# Altium project take1.PrjPcb
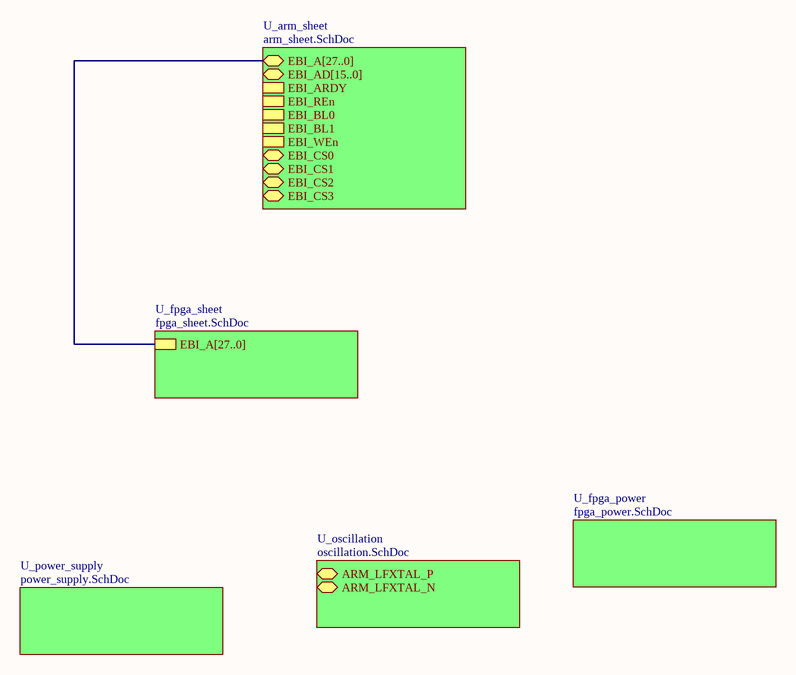
[diagram p0: overall.SchDoc]
6 sheets, 24 parts. Net scope: hierarchical (ports join the sheet entries above them; power ports are global).
Sheets:
  overall.SchDoc
    U_arm_sheet = arm_sheet.SchDoc
    U_fpga_power = fpga_power.SchDoc
    U_fpga_sheet = fpga_sheet.SchDoc
    U_power_supply = power_supply.SchDoc
    U_oscillation = oscillation.SchDoc

## Sheet overall.SchDoc
size A4

### Sub-sheets
U_arm_sheet = arm_sheet.SchDoc: EBI_A[27..0] (bidir), EBI_AD[15..0] (bidir), EBI_ARDY, EBI_REn, EBI_BL0, EBI_BL1, EBI_WEn, EBI_CS0 (bidir), EBI_CS1 (bidir), EBI_CS2 (bidir), EBI_CS3 (bidir)
U_fpga_power = fpga_power.SchDoc: no entries
U_fpga_sheet = fpga_sheet.SchDoc: EBI_A[27..0]
U_oscillation = oscillation.SchDoc: ARM_LFXTAL_P (bidir), ARM_LFXTAL_N (bidir)
U_power_supply = power_supply.SchDoc: no entries

### Buses and harness runs
bus sheet U_arm_sheet/EBI_A[27..0] = sheet U_fpga_sheet/EBI_A[27..0]

## Sheet arm_sheet.SchDoc
size A4
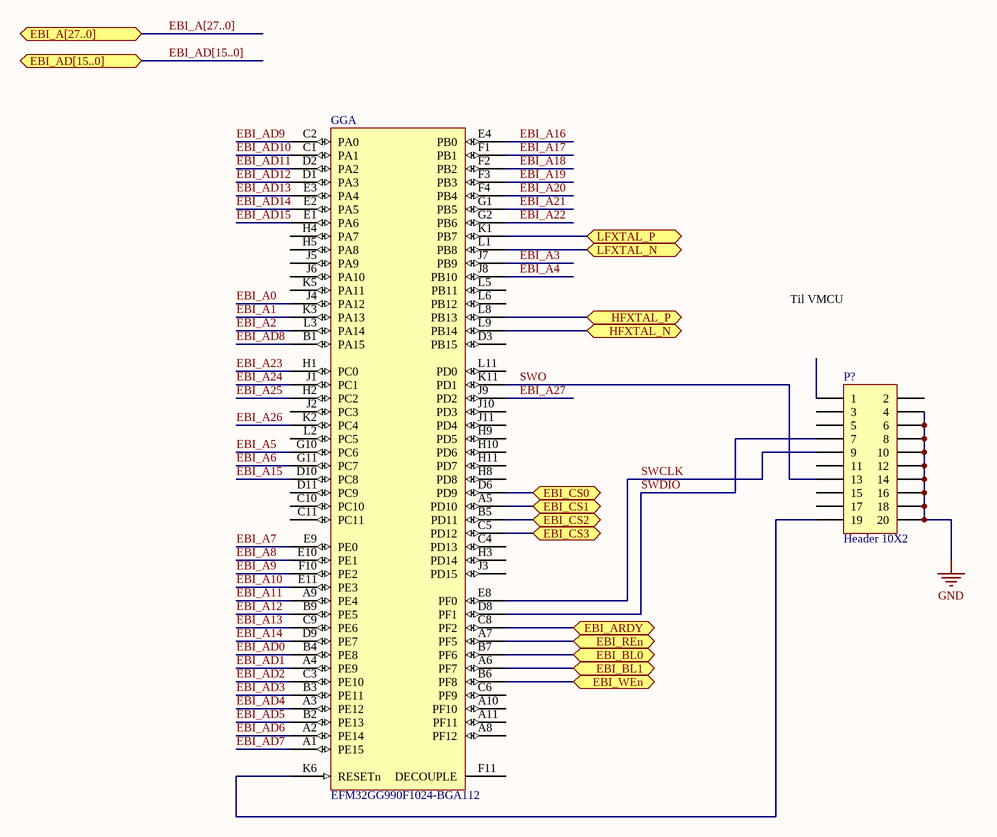
[diagram p1: arm_sheet.SchDoc]

### Parts
GG  EFM32GG990F1024-BGA112  [ENMR-BGA112]  (part A of 2)
P?  Header 10X2  [HDR2X10]

### Ports
EBI_A[27..0] (bidir), EBI_AD[15..0] (bidir), EBI_ARDY, EBI_BL0, EBI_BL1, EBI_CS0 (bidir), EBI_CS1 (bidir), EBI_CS2 (bidir), EBI_CS3 (bidir), EBI_REn, EBI_WEn, HFXTAL_N (bidir), HFXTAL_P (bidir), LFXTAL_N, LFXTAL_P

### Nets
GND: P?.4 P?.6 P?.8 P?.10 P?.12 P?.14 P?.16 P?.18 P?.20
EBI_A0: GG.J4(PA12)
EBI_A1: GG.K3(PA13)
EBI_A2: GG.L3(PA14)
EBI_A3: GG.J7(PB9)
EBI_A4: GG.J8(PB10)
EBI_A5: GG.G10(PC6)
EBI_A6: GG.G11(PC7)
EBI_A7: GG.E9(PE0)
EBI_A8: GG.E10(PE1)
EBI_A9: GG.F10(PE2)
EBI_A10: GG.E11(PE3)
EBI_A11: GG.A9(PE4)
EBI_A12: GG.B9(PE5)
EBI_A13: GG.C9(PE6)
EBI_A14: GG.D9(PE7)
EBI_A15: GG.D10(PC8)
EBI_A16: GG.E4(PB0)
EBI_A17: GG.F1(PB1)
EBI_A18: GG.F2(PB2)
EBI_A19: GG.F3(PB3)
EBI_A20: GG.F4(PB4)
EBI_A21: GG.G1(PB5)
EBI_A22: GG.G2(PB6)
EBI_A23: GG.H1(PC0)
EBI_A24: GG.J1(PC1)
EBI_A25: GG.H2(PC2)
EBI_A26: GG.K2(PC4)
EBI_A27: GG.J9(PD2)
EBI_AD0: GG.B4(PE8)
EBI_AD1: GG.A4(PE9)
EBI_AD2: GG.C3(PE10)
EBI_AD3: GG.B3(PE11)
EBI_AD4: GG.A3(PE12)
EBI_AD5: GG.B2(PE13)
EBI_AD6: GG.A2(PE14)
EBI_AD7: GG.A1(PE15)
EBI_AD8: GG.B1(PA15)
EBI_AD9: GG.C2(PA0)
EBI_AD10: GG.C1(PA1)
EBI_AD11: GG.D2(PA2)
EBI_AD12: GG.D1(PA3)
EBI_AD13: GG.E3(PA4)
EBI_AD14: GG.E2(PA5)
EBI_AD15: GG.E1(PA6)
SWCLK: GG.E8(PF0) P?.9
SWDIO: GG.D8(PF1) P?.7
SWO: GG.K11(PD1) P?.13
NetGG_A5: GG.A5(PD10) ; port EBI_CS1
NetGG_A6: GG.A6(PF7) ; port EBI_BL1
NetGG_A7: GG.A7(PF5) ; port EBI_REn
NetGG_B5: GG.B5(PD11) ; port EBI_CS2
NetGG_B6: GG.B6(PF8) ; port EBI_WEn
NetGG_B7: GG.B7(PF6) ; port EBI_BL0
NetGG_C5: GG.C5(PD12) ; port EBI_CS3
NetGG_C8: GG.C8(PF2) ; port EBI_ARDY
NetGG_D6: GG.D6(PD9) ; port EBI_CS0
NetGG_K1: GG.K1(PB7) ; port LFXTAL_P
NetGG_K6: GG.K6(RESETn) P?.19
NetGG_L1: GG.L1(PB8) ; port LFXTAL_N
NetGG_L8: GG.L8(PB13) ; port HFXTAL_P
NetGG_L9: GG.L9(PB14) ; port HFXTAL_N

Not connected (* = marked no-connect by the designer): GG A8(PF12) A10(PF10) A11(PF11) C4(PD13) C6(PF9) C10(PC10) C11(PC11) D3(PB15) D11(PC9) F11(DECOUPLE) H3(PD14) H4(PA7) H5(PA8) H8(PD8) H9(PD5) H10(PD6) H11(PD7) J2(PC3) J3(PD15) J5(PA9) J6(PA10) J10(PD3) J11(PD4) K5(PA11) L2(PC5) L5(PB11) L6(PB12) L11(PD0); P? 1 2 3 5 11 15 17

### Buses and harness runs
bus EBI_A[27..0] = port EBI_A[27..0]
bus EBI_AD[15..0] = port EBI_AD[15..0]

### Notes on the sheet
- (near P?) Til VMCU

### Library data of the parts
GG = EFM32GG990F1024-BGA112: EFM32 Giant Gecko, M3 ARM Cortex CPU, 1024 KB Flash, 128 KB RAM, 1.85 - 3.8 V Supply, 48 MHz Max Speed, -40 to 85 degC, 112-Pin BGA, RoHS Compliant; Flash (KB): 1024; GPIO: 87; LCD: 8x34; LESENSE: Y; Max Speed (MHz): 48; OPAMPS: 3; RAM (KB): 128; DatasheetVersion: Rev 1.00; PackageVersion: Rev. 97SPP01315A_X03_06Jun11; PackageReference: BGA112; PackageDescription: 112-Pin Ball Grid Array, Body 10 x 10 mm, Pitch 0.8 mm; Supplier 1: Digi-Key; Supplier Part Number 1: 914-1051-2-ND; Supplier 2: Digi-Key; Supplier Part Number 2: 914-1051-1-ND; Supplier 3: Digi-Key; Supplier Part Number 3: 914-1051-6-ND; Supplier 4: Mouser; Supplier Part Number 4: 904-EFM32GG990F1024; ARM Cortex CPU: M3; Subcategory: EFM32 Giant Gecko; Supply Voltage (V): 1.85 - 3.8; USB: Y; Mounting Technology: Surface Mount; Generic Part Number: EFM32GG990; PartNumber: EFM32GG990F1024-BGA112; ComponentLink1Description: Manufacturer URL; ComponentLink1URL: http://www.energymicro.com/; ComponentLink2Description: Datasheet; ComponentLink2URL: http://cdn.energymicro.com/dl/devices/pdf/d0046_efm32gg990_datasheet.pdf; ComponentLink3Description: Package Specification; ComponentLink3URL: http://cdn.energymicro.com/dl/devices/pdf/d0007_efm32g290_datasheet.pdf
P? = Header 10X2: Header, 10-Pin, Dual row; LatestRevisionDate: 17-Jul-2002; LatestRevisionNote: Re-released for DXP Platform.; Publisher: Altium Limited

## Sheet fpga_power.SchDoc
size A4
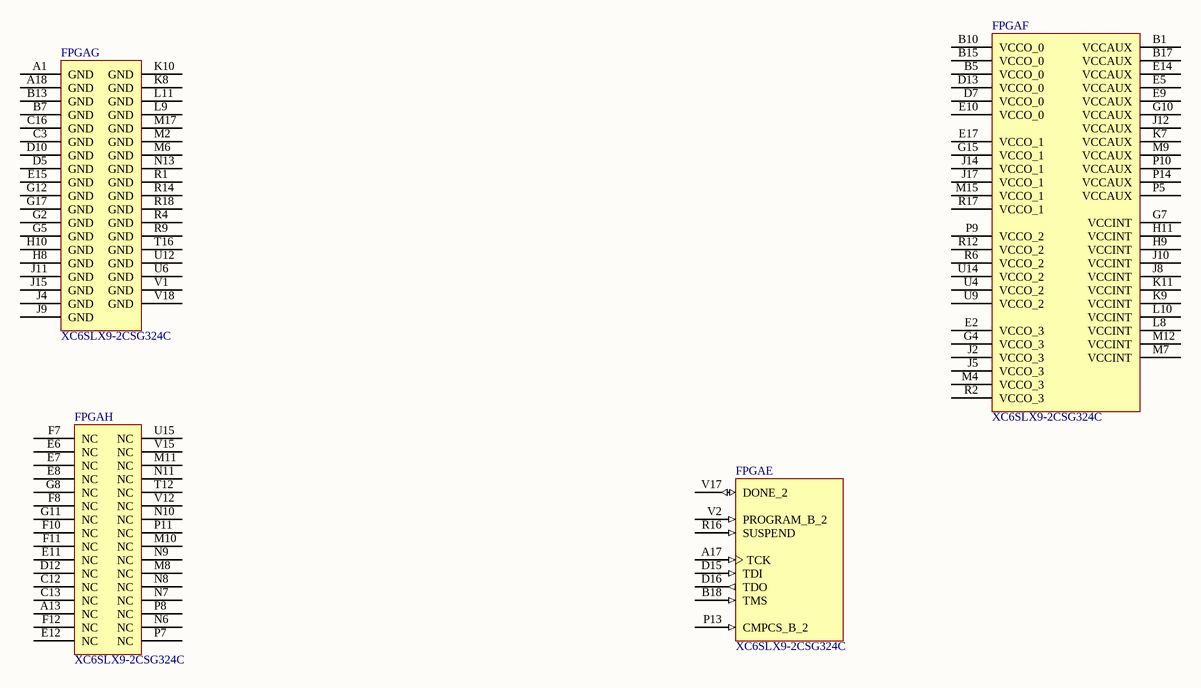
[diagram p2: fpga_power.SchDoc]

### Parts
FPGA  XC6SLX9-2CSG324C  [CSG324]  (parts E,F,G,H of 8)

### Nets

Not connected (* = marked no-connect by the designer): FPGA A1(GND) A13(NC) A17(TCK) A18(GND) B1(VCCAUX) B5(VCCO_0) B7(GND) B10(VCCO_0) B13(GND) B15(VCCO_0) B17(VCCAUX) B18(TMS) C3(GND) C12(NC) C13(NC) C16(GND) D5(GND) D7(VCCO_0) D10(GND) D12(NC) D13(VCCO_0) D15(TDI) D16(TDO) E2(VCCO_3) E5(VCCAUX) E6(NC) E7(NC) E8(NC) E9(VCCAUX) E10(VCCO_0) E11(NC) E12(NC) E14(VCCAUX) E15(GND) E17(VCCO_1) F7(NC) F8(NC) F10(NC) F11(NC) F12(NC) G2(GND) G4(VCCO_3) G5(GND) G7(VCCINT) G8(NC) G10(VCCAUX) G11(NC) G12(GND) G15(VCCO_1) G17(GND) H8(GND) H9(VCCINT) H10(GND) H11(VCCINT) J2(VCCO_3) J4(GND) J5(VCCO_3) J8(VCCINT) J9(GND) J10(VCCINT) J11(GND) J12(VCCAUX) J14(VCCO_1) J15(GND) J17(VCCO_1) K7(VCCAUX) K8(GND) K9(VCCINT) K10(GND) K11(VCCINT) L8(VCCINT) L9(GND) L10(VCCINT) L11(GND) M2(GND) M4(VCCO_3) M6(GND) M7(VCCINT) M8(NC) M9(VCCAUX) M10(NC) M11(NC) M12(VCCINT) M15(VCCO_1) M17(GND) N6(NC) N7(NC) N8(NC) N9(NC) N10(NC) N11(NC) N13(GND) P5(VCCAUX) P7(NC) P8(NC) P9(VCCO_2) P10(VCCAUX) P11(NC) P13(CMPCS_B_2) P14(VCCAUX) R1(GND) R2(VCCO_3) R4(GND) R6(VCCO_2) R9(GND) R12(VCCO_2) R14(GND) R16(SUSPEND) R17(VCCO_1) R18(GND) T12(NC) T16(GND) U4(VCCO_2) U6(GND) U9(VCCO_2) U12(GND) U14(VCCO_2) U15(NC) V1(GND) V2(PROGRAM_B_2) V12(NC) V15(NC) V17(DONE_2) V18(GND)

### Library data of the parts
FPGA = XC6SLX9-2CSG324C: Spartan-6 LX 1.2V FPGA, 200 User I/Os, 324-Ball Chip-Scale BGA (0.8mm Pitch), Speed Grade 2, Commercial Grade, Pb-Free; DatasheetVersion: ver1.6, Nov-2010; PackageVersion: ver1.1, Nov-2009; PackageReference: CSG324; PackageDescription: 324-Ball Chip-Scale BGA (CSG324) Package, 0.8 mm Pitch; Code_JEDEC: MO-275-KKAC-1; ComponentLink1Description: Manufacturer URL; ComponentLink1URL: http://www.xilinx.com/; ComponentLink2Description: Spartan-6 Datasheet; ComponentLink2URL: http://www.xilinx.com/support/documentation/data_sheets/ds160.pdf; ComponentLink3Description: Spartan-6 Documents; ComponentLink3URL: http://www.xilinx.com/support/documentation/spartan-6.htm

## Sheet fpga_sheet.SchDoc
size A4
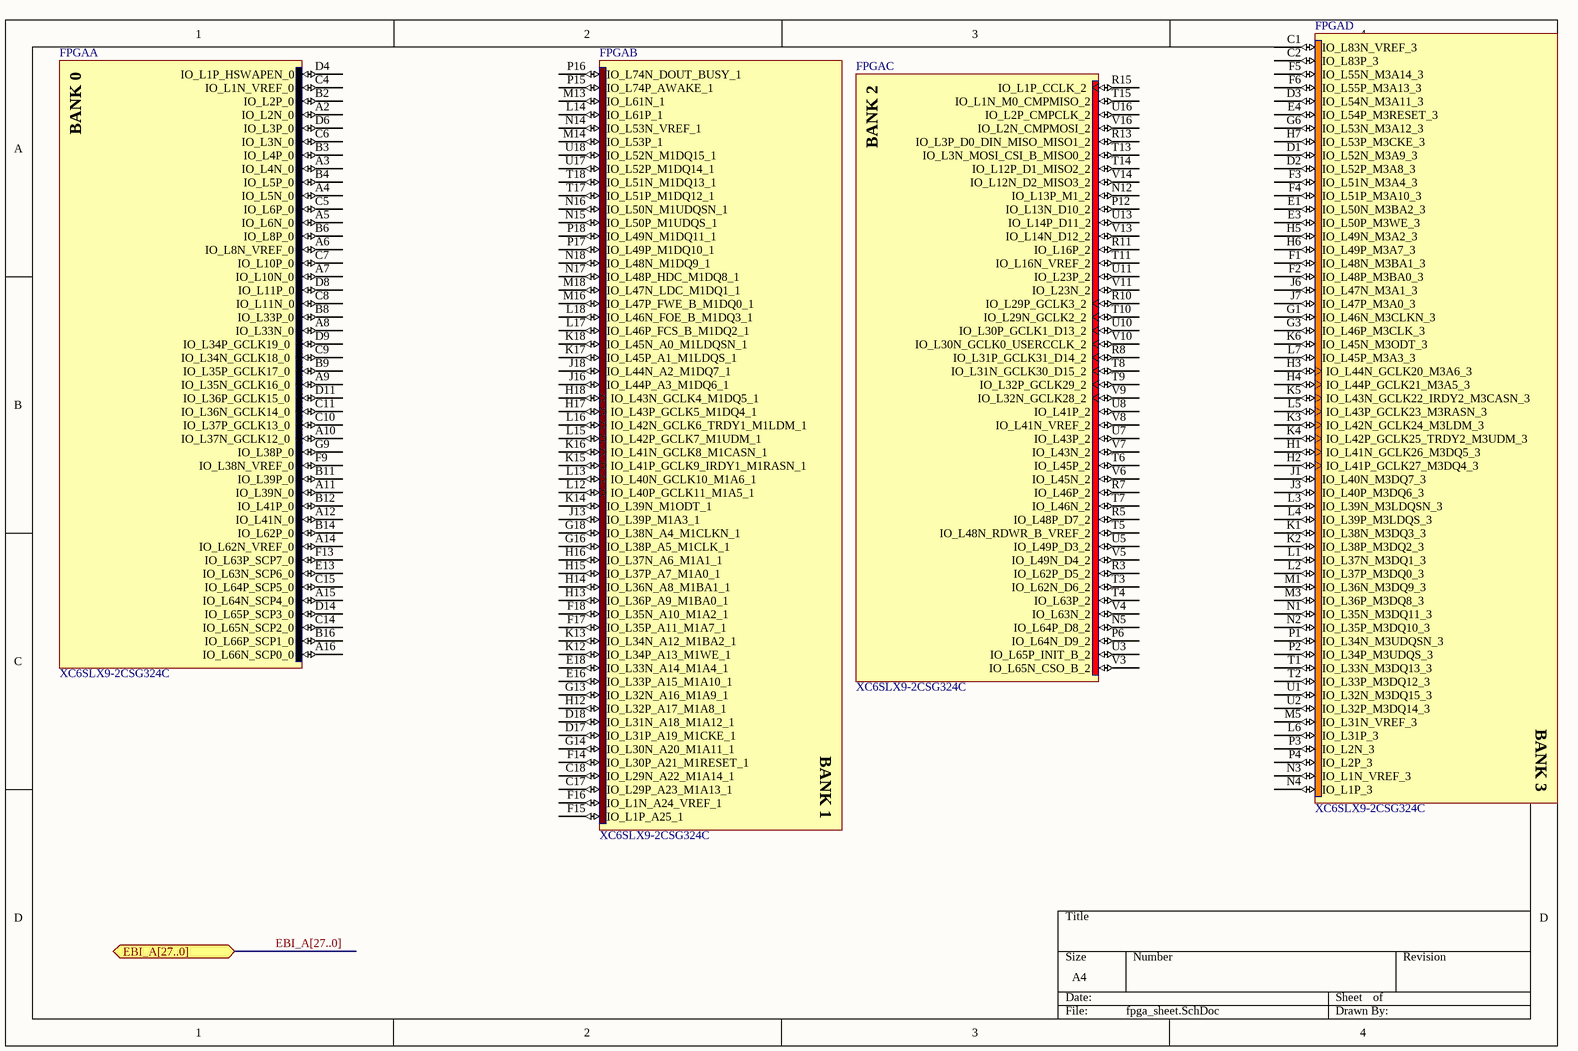
[diagram p3: fpga_sheet.SchDoc]

### Parts
FPGA  XC6SLX9-2CSG324C  [CSG324]  (parts A,B,C,D of 8)

### Ports
EBI_A[27..0]

### Nets

Not connected (* = marked no-connect by the designer): FPGA A2(IO_L2N_0) A3(IO_L4N_0) A4(IO_L5N_0) A5(IO_L6N_0) A6(IO_L8N_VREF_0) A7(IO_L10N_0) A8(IO_L33N_0) A9(IO_L35N_GCLK16_0) A10(IO_L37N_GCLK12_0) A11(IO_L39N_0) A12(IO_L41N_0) A14(IO_L62N_VREF_0) A15(IO_L64N_SCP4_0) A16(IO_L66N_SCP0_0) B2(IO_L2P_0) B3(IO_L4P_0) B4(IO_L5P_0) B6(IO_L8P_0) B8(IO_L33P_0) B9(IO_L35P_GCLK17_0) B11(IO_L39P_0) B12(IO_L41P_0) B14(IO_L62P_0) B16(IO_L66P_SCP1_0) C1(IO_L83N_VREF_3) C2(IO_L83P_3) C4(IO_L1N_VREF_0) C5(IO_L6P_0) C6(IO_L3N_0) C7(IO_L10P_0) C8(IO_L11N_0) C9(IO_L34N_GCLK18_0) C10(IO_L37P_GCLK13_0) C11(IO_L36N_GCLK14_0) C14(IO_L65N_SCP2_0) C15(IO_L64P_SCP5_0) C17(IO_L29P_A23_M1A13_1) C18(IO_L29N_A22_M1A14_1) D1(IO_L52N_M3A9_3) D2(IO_L52P_M3A8_3) D3(IO_L54N_M3A11_3) D4(IO_L1P_HSWAPEN_0) D6(IO_L3P_0) D8(IO_L11P_0) D9(IO_L34P_GCLK19_0) D11(IO_L36P_GCLK15_0) D14(IO_L65P_SCP3_0) D17(IO_L31P_A19_M1CKE_1) D18(IO_L31N_A18_M1A12_1) E1(IO_L50N_M3BA2_3) E3(IO_L50P_M3WE_3) E4(IO_L54P_M3RESET_3) E13(IO_L63N_SCP6_0) E16(IO_L33P_A15_M1A10_1) E18(IO_L33N_A14_M1A4_1) F1(IO_L48N_M3BA1_3) F2(IO_L48P_M3BA0_3) F3(IO_L51N_M3A4_3) F4(IO_L51P_M3A10_3) F5(IO_L55N_M3A14_3) F6(IO_L55P_M3A13_3) F9(IO_L38N_VREF_0) F13(IO_L63P_SCP7_0) F14(IO_L30P_A21_M1RESET_1) F15(IO_L1P_A25_1) F16(IO_L1N_A24_VREF_1) F17(IO_L35P_A11_M1A7_1) F18(IO_L35N_A10_M1A2_1) G1(IO_L46N_M3CLKN_3) G3(IO_L46P_M3CLK_3) G6(IO_L53N_M3A12_3) G9(IO_L38P_0) G13(IO_L32N_A16_M1A9_1) G14(IO_L30N_A20_M1A11_1) G16(IO_L38P_A5_M1CLK_1) G18(IO_L38N_A4_M1CLKN_1) H1(IO_L41N_GCLK26_M3DQ5_3) H2(IO_L41P_GCLK27_M3DQ4_3) H3(IO_L44N_GCLK20_M3A6_3) H4(IO_L44P_GCLK21_M3A5_3) H5(IO_L49N_M3A2_3) H6(IO_L49P_M3A7_3) H7(IO_L53P_M3CKE_3) H12(IO_L32P_A17_M1A8_1) H13(IO_L36P_A9_M1BA0_1) H14(IO_L36N_A8_M1BA1_1) H15(IO_L37P_A7_M1A0_1) H16(IO_L37N_A6_M1A1_1) H17(IO_L43P_GCLK5_M1DQ4_1) H18(IO_L43N_GCLK4_M1DQ5_1) J1(IO_L40N_M3DQ7_3) J3(IO_L40P_M3DQ6_3) J6(IO_L47N_M3A1_3) J7(IO_L47P_M3A0_3) J13(IO_L39P_M1A3_1) J16(IO_L44P_A3_M1DQ6_1) J18(IO_L44N_A2_M1DQ7_1) K1(IO_L38N_M3DQ3_3) K2(IO_L38P_M3DQ2_3) K3(IO_L42N_GCLK24_M3LDM_3) K4(IO_L42P_GCLK25_TRDY2_M3UDM_3) K5(IO_L43N_GCLK22_IRDY2_M3CASN_3) K6(IO_L45N_M3ODT_3) K12(IO_L34P_A13_M1WE_1) K13(IO_L34N_A12_M1BA2_1) K14(IO_L39N_M1ODT_1) K15(IO_L41P_GCLK9_IRDY1_M1RASN_1) K16(IO_L41N_GCLK8_M1CASN_1) K17(IO_L45P_A1_M1LDQS_1) K18(IO_L45N_A0_M1LDQSN_1) L1(IO_L37N_M3DQ1_3) L2(IO_L37P_M3DQ0_3) L3(IO_L39N_M3LDQSN_3) L4(IO_L39P_M3LDQS_3) L5(IO_L43P_GCLK23_M3RASN_3) L6(IO_L31P_3) L7(IO_L45P_M3A3_3) L12(IO_L40P_GCLK11_M1A5_1) L13(IO_L40N_GCLK10_M1A6_1) L14(IO_L61P_1) L15(IO_L42P_GCLK7_M1UDM_1) L16(IO_L42N_GCLK6_TRDY1_M1LDM_1) L17(IO_L46P_FCS_B_M1DQ2_1) L18(IO_L46N_FOE_B_M1DQ3_1) M1(IO_L36N_M3DQ9_3) M3(IO_L36P_M3DQ8_3) M5(IO_L31N_VREF_3) M13(IO_L61N_1) M14(IO_L53P_1) M16(IO_L47P_FWE_B_M1DQ0_1) M18(IO_L47N_LDC_M1DQ1_1) N1(IO_L35N_M3DQ11_3) N2(IO_L35P_M3DQ10_3) N3(IO_L1N_VREF_3) N4(IO_L1P_3) N5(IO_L64P_D8_2) N12(IO_L13P_M1_2) N14(IO_L53N_VREF_1) N15(IO_L50P_M1UDQS_1) N16(IO_L50N_M1UDQSN_1) N17(IO_L48P_HDC_M1DQ8_1) N18(IO_L48N_M1DQ9_1) P1(IO_L34N_M3UDQSN_3) P2(IO_L34P_M3UDQS_3) P3(IO_L2N_3) P4(IO_L2P_3) P6(IO_L64N_D9_2) P12(IO_L13N_D10_2) P15(IO_L74P_AWAKE_1) P16(IO_L74N_DOUT_BUSY_1) P17(IO_L49P_M1DQ10_1) P18(IO_L49N_M1DQ11_1) R3(IO_L62P_D5_2) R5(IO_L48P_D7_2) R7(IO_L46P_2) R8(IO_L31P_GCLK31_D14_2) R10(IO_L29P_GCLK3_2) R11(IO_L16P_2) R13(IO_L3P_D0_DIN_MISO_MISO1_2) R15(IO_L1P_CCLK_2) T1(IO_L33N_M3DQ13_3) T2(IO_L33P_M3DQ12_3) T3(IO_L62N_D6_2) T4(IO_L63P_2) T5(IO_L48N_RDWR_B_VREF_2) T6(IO_L45P_2) T7(IO_L46N_2) T8(IO_L31N_GCLK30_D15_2) T9(IO_L32P_GCLK29_2) T10(IO_L29N_GCLK2_2) T11(IO_L16N_VREF_2) T13(IO_L3N_MOSI_CSI_B_MISO0_2) T14(IO_L12P_D1_MISO2_2) T15(IO_L1N_M0_CMPMISO_2) T17(IO_L51P_M1DQ12_1) T18(IO_L51N_M1DQ13_1) U1(IO_L32N_M3DQ15_3) U2(IO_L32P_M3DQ14_3) U3(IO_L65P_INIT_B_2) U5(IO_L49P_D3_2) U7(IO_L43P_2) U8(IO_L41P_2) U10(IO_L30P_GCLK1_D13_2) U11(IO_L23P_2) U13(IO_L14P_D11_2) U16(IO_L2P_CMPCLK_2) U17(IO_L52P_M1DQ14_1) U18(IO_L52N_M1DQ15_1) V3(IO_L65N_CSO_B_2) V4(IO_L63N_2) V5(IO_L49N_D4_2) V6(IO_L45N_2) V7(IO_L43N_2) V8(IO_L41N_VREF_2) V9(IO_L32N_GCLK28_2) V10(IO_L30N_GCLK0_USERCCLK_2) V11(IO_L23N_2) V13(IO_L14N_D12_2) V14(IO_L12N_D2_MISO3_2) V16(IO_L2N_CMPMOSI_2)

### Buses and harness runs
bus EBI_A[27..0] = port EBI_A[27..0]

### Notes on the sheet
- (in symbol XC6SLX9-2CSG324C, part A) BANK 0
- (in symbol XC6SLX9-2CSG324C, part B) BANK 1
- (in symbol XC6SLX9-2CSG324C, part C) BANK 2
- (in symbol XC6SLX9-2CSG324C, part D) BANK 3

### Library data of the parts
FPGA = XC6SLX9-2CSG324C: as FPGA on sheet fpga_power; DatasheetVersion: ver1.6, Nov-2010; PackageVersion: ver1.1, Nov-2009; PackageReference: CSG324; PackageDescription: 324-Ball Chip-Scale BGA (CSG324) Package, 0.8 mm Pitch; Code_JEDEC: MO-275-KKAC-1; ComponentLink1Description: Manufacturer URL; ComponentLink1URL: http://www.xilinx.com/; ComponentLink2Description: Spartan-6 Datasheet; ComponentLink2URL: http://www.xilinx.com/support/documentation/data_sheets/ds160.pdf; ComponentLink3Description: Spartan-6 Documents; ComponentLink3URL: http://www.xilinx.com/support/documentation/spartan-6.htm

## Sheet power_supply.SchDoc
size A4
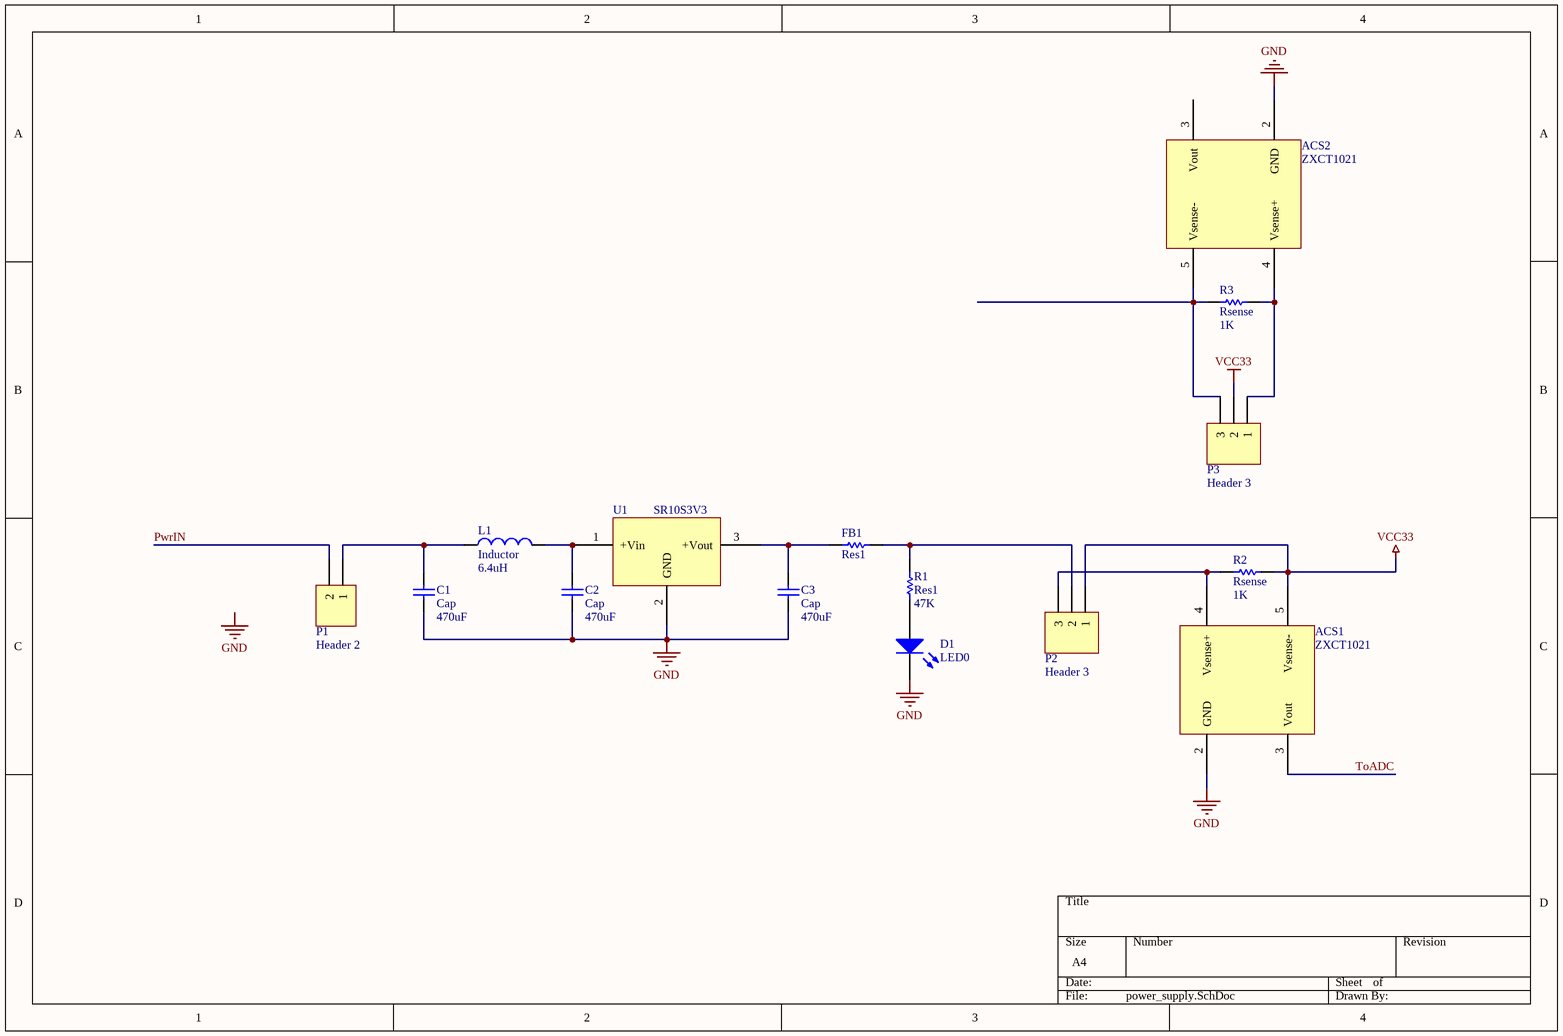
[diagram p4: power_supply.SchDoc]

### Parts
(Parts that share a designator on the sheet are numbered #1, #2 ... from top to bottom, then left to right.)
ACS1  ZXCT1021
ACS2  ZXCT1021
C1#1  Cap  value 470uF  [RAD-0.3]
C2#1  Cap  value 470uF  [RAD-0.3]
C3#1  Cap  value 470uF  [RAD-0.3]
D1  LED0  [LED-0]
FB1  Res1  [AXIAL-0.3]
L1  Inductor  value 6.4uH  [0402-A]
P1  Header 2  [HDR1X2]
P2  Header 3  [HDR1X3]
P3  Header 3  [HDR1X3]
R1  Res1  value 47K  [AXIAL-0.3]
R2  Rsense  value 1K  [AXIAL-0.3]
R3  Rsense  value 1K  [AXIAL-0.3]
U1  SR10S3V3  [SR10S3V3_Footprint]

### Nets
GND: ACS1.2(GND) ACS2.2(GND) C1#1.1 C2#1.1 C3#1.1 D1.2(K) U1.2(GND)
VCC33: ACS1.5(Vsense-) P2.1 P3.2 R2.1
PwrIN: P1.2
ToADC: ACS1.3(Vout)
NetACS1_4: ACS1.4(Vsense+) P2.3 R2.2
NetACS2_4: ACS2.4(Vsense+) P3.1 R3.1
NetACS2_5: ACS2.5(Vsense-) P3.3 R3.2
NetC1#1_2: C1#1.2 L1.1 P1.1
NetC2#1_2: C2#1.2 L1.2 U1.1(+Vin)
NetC3#1_2: C3#1.2 FB1.1 U1.3(+Vout)
NetD1_1: D1.1(A) R1.1
NetFB1_2: FB1.2 P2.2 R1.2

Not connected (* = marked no-connect by the designer): ACS2 3(Vout)

### Notes on the sheet
- Labels drawn without touching a wire or pin: GND

### Library data of the parts
C1#1 C2#1 C3#1 = Cap: Capacitor; Published: 8-Jun-2000; LatestRevisionDate: 17-Jul-2002; LatestRevisionNote: Re-released for DXP Platform.; PackageReference: RAD-0.3; Publisher: Altium Limited; PackageDescription: Radial Cap, Thru-Hole; 2 Leads; 0.3 in Pin Spacing
D1 = LED0: Typical INFRARED GaAs LED; Published: 8-Jun-2000; LatestRevisionDate: 08-Jul-2005; LatestRevisionNote: Mech Layer 1 removed.; PackageReference: LED-0; Publisher: Altium Limited; PackageDescription: LED; 2 Leads
FB1 = Res1: Resistor; Value: 1K; Published: 8-Jun-2000; LatestRevisionDate: 17-Jul-2002; LatestRevisionNote: Re-released for DXP Platform.; PackageReference: AXIAL-0.3; Publisher: Altium Limited; PackageDescription: Axial Device, Thru-Hole; 2 Leads; 0.3 in Pin Spacing
L1 = Inductor: Code_IEC: 1005; Published: 8-Jun-2000; LatestRevisionDate: 29-May-2009; LatestRevisionNote: IPC-7351 Footprint Added.; PackageReference: 0402-A; Publisher: Altium Limited; PackageDescription: Chip Inductor; Code_JEITA: 0402
P1 = Header 2: Header, 2-Pin; LatestRevisionDate: 17-Jul-2002; LatestRevisionNote: Re-released for DXP Platform.; Publisher: Altium Limited
P2 P3 = Header 3: Header, 3-Pin; LatestRevisionDate: 17-Jul-2002; LatestRevisionNote: Re-released for DXP Platform.; Publisher: Altium Limited
R1-R3 = Res1: Resistor; Published: 8-Jun-2000; LatestRevisionDate: 17-Jul-2002; LatestRevisionNote: Re-released for DXP Platform.; PackageReference: AXIAL-0.3; Publisher: Altium Limited; PackageDescription: Axial Device, Thru-Hole; 2 Leads; 0.3 in Pin Spacing

## Sheet oscillation.SchDoc
size A4
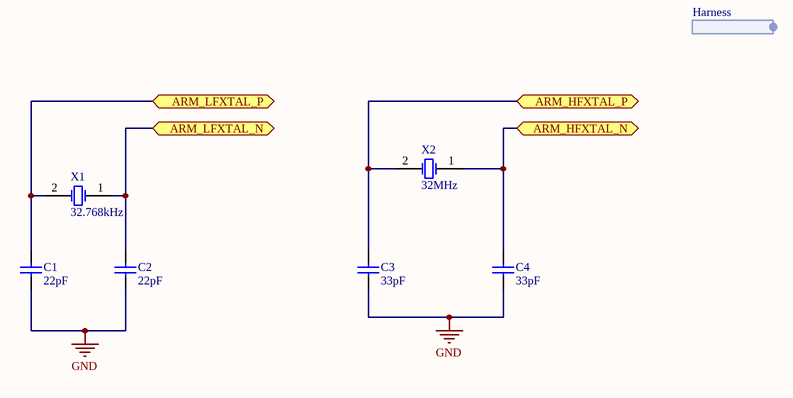
[diagram p5: oscillation.SchDoc]

### Parts
(Parts that share a designator on the sheet are numbered #1, #2 ... from top to bottom, then left to right.)
C1#2  value 22pF  [RAD-0.3]  (hidden comment: Cap)
C2#2  value 22pF  [RAD-0.3]  (hidden comment: Cap)
C3#2  value 33pF  [RAD-0.3]  (hidden comment: Cap)
C4  value 33pF  [RAD-0.3]  (hidden comment: Cap)
X1  32.768kHz  [R38]
X2  32MHz  [R38]

### Ports
ARM_HFXTAL_N (bidir), ARM_HFXTAL_P (bidir), ARM_LFXTAL_N (bidir), ARM_LFXTAL_P (bidir)

### Harnesses
Harness: 

### Nets
GND: C1#2.1 C2#2.1 C3#2.1 C4.1
NetC1#2_2: C1#2.2 X1.2(OSC2) ; port ARM_LFXTAL_P
NetC2#2_2: C2#2.2 X1.1(OSC1) ; port ARM_LFXTAL_N
NetC3#2_2: C3#2.2 X2.2(OSC2) ; port ARM_HFXTAL_P
NetC4_2: C4.2 X2.1(OSC1) ; port ARM_HFXTAL_N

### Library data of the parts
C1#2 C2#2 C3#2 C4 = Cap: Capacitor; Published: 8-Jun-2000; LatestRevisionDate: 17-Jul-2002; LatestRevisionNote: Re-released for DXP Platform.; PackageReference: RAD-0.3; Publisher: Altium Limited; PackageDescription: Radial Cap, Thru-Hole; 2 Leads; 0.3 in Pin Spacing
X1 X2 = XTAL: Crystal Oscillator; Published: 8-Jun-2000; LatestRevisionDate: 17-Jul-2002; LatestRevisionNote: Re-released for DXP Platform.; PackageReference: R38; Publisher: Altium Limited; PackageDescription: Crystal, Thru-Hole; 2 Leads; Body 3.1 x 8.2 mm (Dia.xH)

## Nets that join several sheets
GND: arm_sheet (9 pins), power_supply (7 pins), oscillation (C1#2.1 C2#2.1 C3#2.1 C4.1)